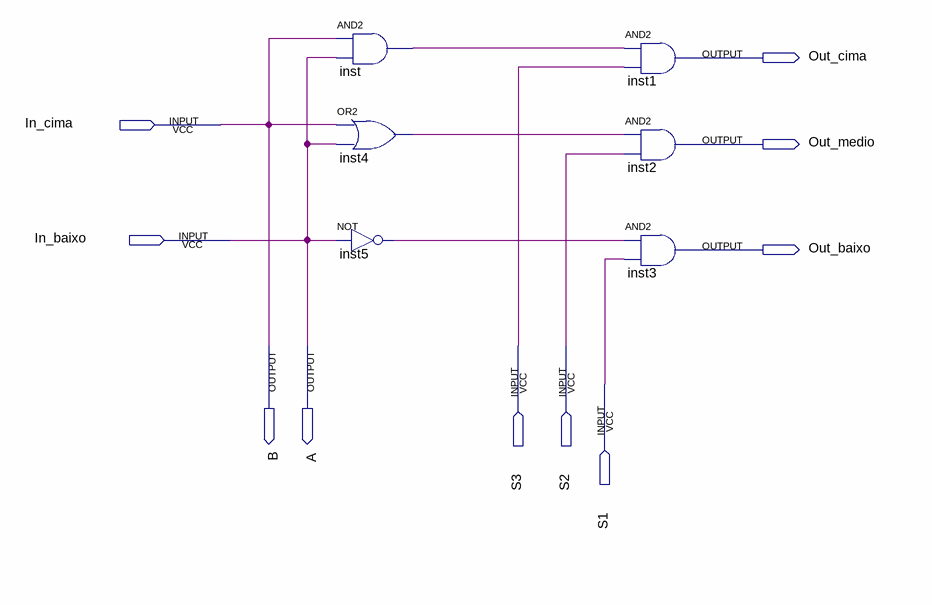
[diagram p0: schematic sheet]
// Quartus schematic Logic_Unity.bdf as structural Verilog: 6 symbols, 10 pins
module Logic_Unity (
  input  In_cima,
  input  In_baixo,
  input  S3,
  input  S2,
  input  S1,
  output Out_cima,
  output Out_medio,
  output Out_baixo,
  output B,
  output A
);

  wire inst4_out, inst5_out, inst_out;

  and inst (inst_out, In_cima, In_baixo);
  or inst4 (inst4_out, In_cima, In_baixo);
  not inst5 (inst5_out, In_baixo);
  and inst1 (Out_cima, inst_out, S3);
  and inst2 (Out_medio, inst4_out, S2);
  and inst3 (Out_baixo, inst5_out, S1);

  assign A = In_baixo;
  assign B = In_cima;
endmodule
